# Altium project DTCP v1.2.PrjPcb (part 1 of 2)
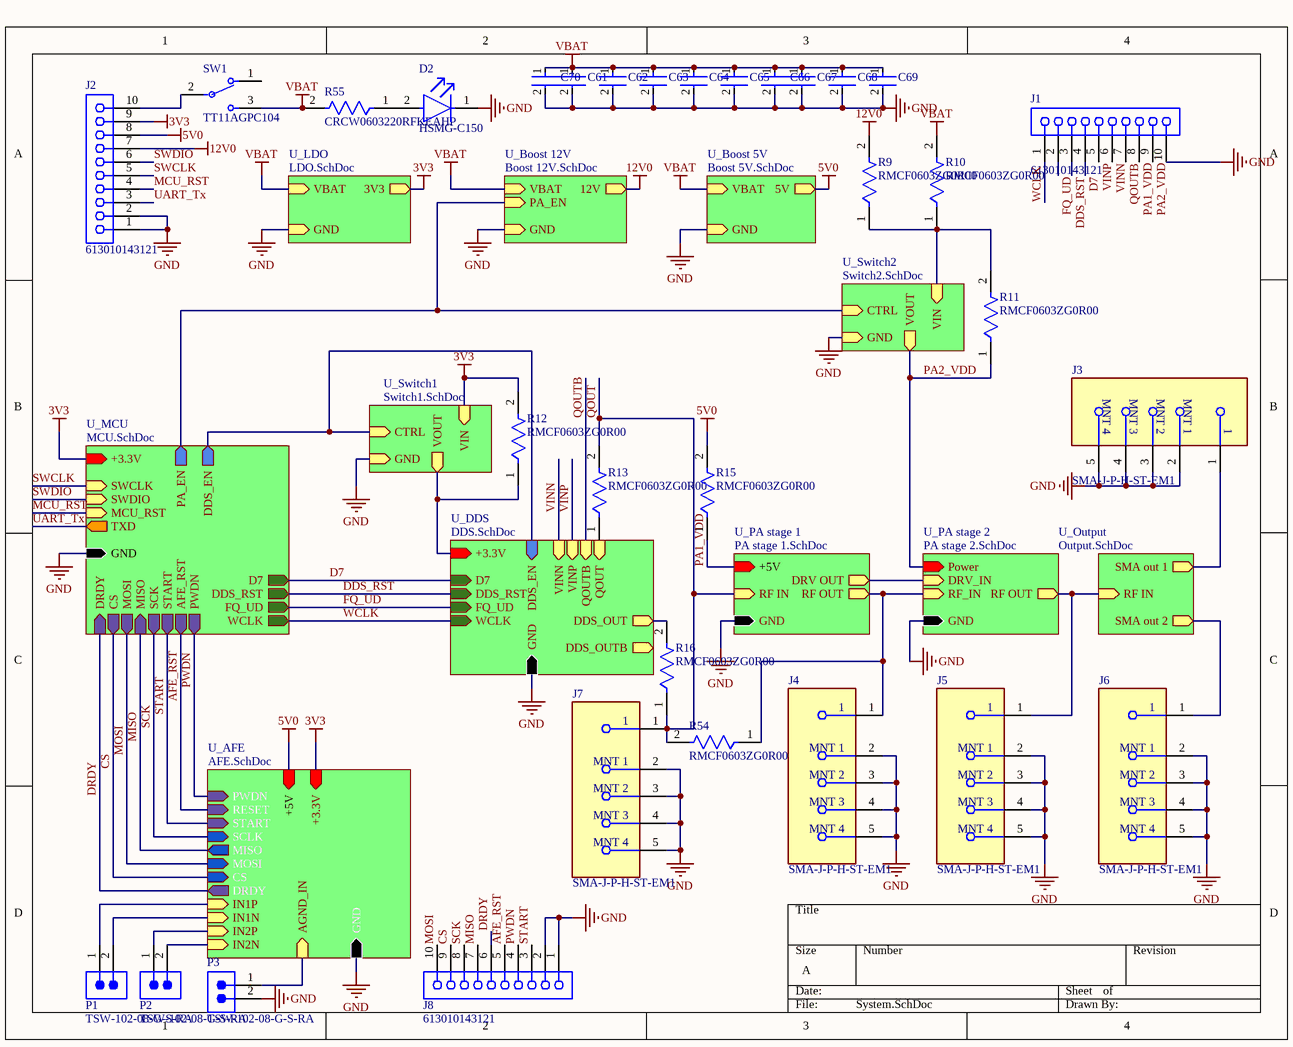
[diagram p0: System.SchDoc]
12 sheets, 176 parts. Net scope: hierarchical (ports join the sheet entries above them; power ports are global).
Board file: PCB1.PcbDoc
Sheets:
  System.SchDoc
    U_MCU = MCU.SchDoc
    U_DDS = DDS.SchDoc
    U_PA stage 1 = PA stage 1.SchDoc
    U_PA stage 2 = PA stage 2.SchDoc
    U_LDO = LDO.SchDoc
    U_Output = Output.SchDoc
    U_Boost 12V = Boost 12V.SchDoc
    U_Switch1 = Switch1.SchDoc
    U_Switch2 = Switch2.SchDoc
    U_Boost 5V = Boost 5V.SchDoc
    U_AFE = AFE.SchDoc

## Sheet System.SchDoc
size A; SheetNumber: 1; SheetTotal: 12

### Parts
C61  GRM21BR60J107ME15K  [FP-GRM21B-0_2-e0_2_0_7-IPC_B]  (value not drawn)
C62  GRM21BR60J107ME15K  [FP-GRM21B-0_2-e0_2_0_7-IPC_B]  (value not drawn)
C63  GRM21BR60J107ME15K  [FP-GRM21B-0_2-e0_2_0_7-IPC_B]  (value not drawn)
C64  GRM21BR60J107ME15K  [FP-GRM21B-0_2-e0_2_0_7-IPC_B]  (value not drawn)
C65  GRM21BR60J107ME15K  [FP-GRM21B-0_2-e0_2_0_7-IPC_B]  (value not drawn)
C66  GRM21BR60J107ME15K  [FP-GRM21B-0_2-e0_2_0_7-IPC_B]  (value not drawn)
C67  GRM21BR60J107ME15K  [FP-GRM21B-0_2-e0_2_0_7-IPC_B]  (value not drawn)
C68  GRM21BR60J107ME15K  [FP-GRM21B-0_2-e0_2_0_7-IPC_B]  (value not drawn)
C69  GRM21BR60J107ME15K  [FP-GRM21B-0_2-e0_2_0_7-IPC_B]  (value not drawn)
C70  GRM21BR60J107ME15K  [FP-GRM21B-0_2-e0_2_0_7-IPC_B]  (value not drawn)
D2  HSMG-C150  [FP-HSMG-C150-MFG]
J1  613010143121  [613010143121]
J2  613010143121  [613010143121]
J3  SMA-J-P-H-ST-EM1  [FP-SMA-J-P-H-ST-EM1-MFG]
J4  SMA-J-P-H-ST-EM1  [FP-SMA-J-P-H-ST-EM1-MFG]
J5  SMA-J-P-H-ST-EM1  [FP-SMA-J-P-H-ST-EM1-MFG]
J6  SMA-J-P-H-ST-EM1  [FP-SMA-J-P-H-ST-EM1-MFG]
J7  SMA-J-P-H-ST-EM1  [FP-SMA-J-P-H-ST-EM1-MFG]
J8  613010143121  [613010143121]
P1  TSW-102-08-G-S-RA  [SMTC-TSW-102-08-X-S-RA]
P2  TSW-102-08-G-S-RA  [SMTC-TSW-102-08-X-S-RA]
P3  TSW-102-08-G-S-RA  [SMTC-TSW-102-08-X-S-RA]
R9  RMCF0603ZG0R00  [FP-RMCF0603-IPC_B]
R10  RMCF0603ZG0R00  [FP-RMCF0603-IPC_B]
R11  RMCF0603ZG0R00  [FP-RMCF0603-IPC_B]
R12  RMCF0603ZG0R00  [FP-RMCF0603-IPC_B]
R13  RMCF0603ZG0R00  [FP-RMCF0603-IPC_B]
R15  RMCF0603ZG0R00  [FP-RMCF0603-IPC_B]
R16  RMCF0603ZG0R00  [FP-RMCF0603-IPC_B]
R54  RMCF0603ZG0R00  [FP-RMCF0603-IPC_B]
R55  CRCW0603220RFKEAHP  [FP-CRCW0603-HPe3-IPC_A]
SW1  TT11AGPC104  [FP-TT11AGPC104-MFG]

### Sub-sheets
U_AFE = AFE.SchDoc: +5V (in), GND (in), +3.3V (in), DRDY (out), CS (in), SCLK (in), MISO (out), MOSI (in), START (in), PWDN (in), RESET (in), IN1P (in), IN1N (in), IN2P (in), IN2N (in), AGND_IN (in)
U_Boost 5V = Boost 5V.SchDoc: VBAT (in), GND (in), 5V (out)
U_Boost 12V = Boost 12V.SchDoc: VBAT (in), GND (in), 12V (out), PA_EN (in)
U_DDS = DDS.SchDoc: DDS_OUTB (out), DDS_OUT (out), D7 (in), DDS_RST (in), FQ_UD (in), WCLK (in), +3.3V (in), GND (in), DDS_EN (in), VINN (in), VINP (in), QOUTB (in), QOUT (in)
U_LDO = LDO.SchDoc: VBAT (in), GND (in), 3V3 (out)
U_MCU = MCU.SchDoc: +3.3V (in), GND (in), SWCLK (in), SWDIO (in), MCU_RST (in), TXD (out), CS (out), MOSI (out), MISO (in), SCK (out), D7 (out), DDS_RST (out), FQ_UD (out), WCLK (out), PWDN (out), START (out), AFE_RST (out), PA_EN (out), DDS_EN (out), DRDY (in)
U_Output = Output.SchDoc: RF IN (in), SMA out 1 (out), SMA out 2 (out)
U_PA stage 1 = PA stage 1.SchDoc: RF IN (in), RF OUT (out), +5V (in), GND (in), DRV OUT (out)
U_PA stage 2 = PA stage 2.SchDoc: GND (in), RF OUT (out), Power (in), RF_IN (in), DRV_IN (in)
U_Switch1 = Switch1.SchDoc: VIN (in), VOUT (out), CTRL (in), GND (in)
U_Switch2 = Switch2.SchDoc: VIN (in), VOUT (out), CTRL (in), GND (in)

### Nets
3V3: J2.9 R12.2 ; sheet U_MCU/+3.3V, sheet U_LDO/3V3, sheet U_Switch1/VIN, sheet U_AFE/+3.3V
3V3DDS: R12.1 ; sheet U_DDS/+3.3V, sheet U_Switch1/VOUT
5V0: J2.8 R15.2 ; sheet U_Boost 5V/5V, sheet U_AFE/+5V
12V0: J2.7 R9.2 ; sheet U_Boost 12V/12V
GND: C61.2 C62.2 C63.2 C64.2 C65.2 C66.2 C67.2 C68.2 C69.2 C70.2 D2.1(C) J1.10 J2.1 J2.2 J3.2(MNT_1) J3.3(MNT_2) J3.4(MNT_3) J3.5(MNT_4) J4.2(MNT_1) J4.3(MNT_2) J4.4(MNT_3) J4.5(MNT_4) J5.2(MNT_1) J5.3(MNT_2) J5.4(MNT_3) J5.5(MNT_4) J6.2(MNT_1) J6.3(MNT_2) J6.4(MNT_3) J6.5(MNT_4) J7.2(MNT_1) J7.3(MNT_2) J7.4(MNT_3) J7.5(MNT_4) J8.1 J8.2 P3.2 ; sheet U_MCU/GND, sheet U_DDS/GND, sheet U_PA stage 1/GND, sheet U_PA stage 2/GND, sheet U_LDO/GND, sheet U_Boost 12V/GND, sheet U_Switch1/GND, sheet U_Switch2/GND, sheet U_Boost 5V/GND, sheet U_AFE/GND
PA1_VDD: J1.8 R15.1 ; sheet U_PA stage 1/+5V
VBAT: C61.1 C62.1 C63.1 C64.1 C65.1 C66.1 C67.1 C68.1 C69.1 C70.1 R10.2 R55.2 SW1.3 ; sheet U_LDO/VBAT, sheet U_Boost 12V/VBAT, sheet U_Boost 5V/VBAT
AFE_RST: J8.5 ; sheet U_MCU/AFE_RST, sheet U_AFE/RESET
CS: J8.9 ; sheet U_MCU/CS, sheet U_AFE/CS
D7: J1.4 ; sheet U_MCU/D7, sheet U_DDS/D7
DDS_OUT: R16.2 ; sheet U_DDS/DDS_OUT
DDS_RST: J1.3 ; sheet U_MCU/DDS_RST, sheet U_DDS/DDS_RST
DRDY: J8.6 ; sheet U_MCU/DRDY, sheet U_AFE/DRDY
FQ_UD: J1.2 ; sheet U_MCU/FQ_UD, sheet U_DDS/FQ_UD
MCU_RST: J2.4 ; sheet U_MCU/MCU_RST
MISO: J8.7 ; sheet U_MCU/MISO, sheet U_AFE/MISO
MOSI: J8.10 ; sheet U_MCU/MOSI, sheet U_AFE/MOSI
PA2_VDD: J1.9 R11.1 ; sheet U_PA stage 2/Power, sheet U_Switch2/VOUT
PWDN: J8.4 ; sheet U_MCU/PWDN, sheet U_AFE/PWDN
QOUT: J7.1 R13.2 R16.1 R54.2 ; sheet U_PA stage 1/RF IN
QOUTB: J1.7 ; sheet U_DDS/QOUTB
SCK: J8.8 ; sheet U_MCU/SCK, sheet U_AFE/SCLK
START: J8.3 ; sheet U_MCU/START, sheet U_AFE/START
SWCLK: J2.5 ; sheet U_MCU/SWCLK
SWDIO: J2.6 ; sheet U_MCU/SWDIO
UART_Tx: J2.3 ; sheet U_MCU/TXD  [project net TXD]
VINN: J1.6 ; sheet U_DDS/VINN
VINP: J1.5 ; sheet U_DDS/VINP
WCLK: J1.1 ; sheet U_MCU/WCLK, sheet U_DDS/WCLK  [project net DDS_WCLK]
NetC47_2: R9.1 R10.1 R11.2 ; sheet U_Switch2/VIN
NetD2_2: D2.2(A) R55.1
NetJ2_10: J2.10 SW1.2
NetJ3_1: J3.1 ; sheet U_Output/SMA out 1
NetJ4_1: J4.1 R54.1 ; sheet U_PA stage 1/RF OUT, sheet U_PA stage 2/RF_IN
NetJ5_1: J5.1 ; sheet U_PA stage 2/RF OUT, sheet U_Output/RF IN
NetJ6_1: J6.1 ; sheet U_Output/SMA out 2
NetP1_1: P1.1 ; sheet U_AFE/IN1P
NetP1_2: P1.2 ; sheet U_AFE/IN1N
NetP2_1: P2.1 ; sheet U_AFE/IN2P
NetP2_2: P2.2 ; sheet U_AFE/IN2N
NetP3_1: P3.1 ; sheet U_AFE/AGND_IN
NetQ1_1: sheet U_PA stage 1/DRV OUT, sheet U_PA stage 2/DRV_IN
NetR1_2: sheet U_MCU/DDS_EN, sheet U_DDS/DDS_EN, sheet U_Switch1/CTRL
NetR13_1: R13.1 ; sheet U_DDS/QOUT
NetR?#2_1: sheet U_MCU/PA_EN, sheet U_Boost 12V/PA_EN, sheet U_Switch2/CTRL

Not connected (* = marked no-connect by the designer): SW1 1

### Library data of the parts
C61-C70 = CMP-06035-052658-1: Chip Multilayer Ceramic Capacitors for General Purpose, 0805, 100uF, X5R, 15%, 20%, 6.3V; Voltage Rating (DC): 6.3V; Lead Free: Lead Free; Length: 2mm; Tolerance: 20%; Width: 1.25mm; Capacitance: 100uF; Dielectric: X5R; Thickness: 1.25mm
D2 = CMP-2000-05061-2: LED GREEN DIFFUSED 1206 SMD; Manufacturer: Broadcom; Led Orientation: Top View; Max Junction Temp: +95°C; Peak Emmision Wavelength: 570nm; Viewing Angle: 170°; Wavelength: 572nm; Reverse Voltage: 5V; Luminous Intensity: 15mcd; Forward Voltage: 2.2V; Power Dissipation: 65mW; Forward Current: 20mA; ComponentLink2Description: Datasheet; Lead Free: Yes; Temperature Range Low: -40°C; Package: HSMG-C150; Digikey Description: LED GREEN DIFFUSED 1206 SMD; Mouser Description: LED Uni-Color Green 570nm 2-Pin Chip LED T/R; Manufacturer Part Number: HSMG-C150; Temperature Range High: +85°C; Device Class L1: Optoelectronics; Colour: Green; Category: Diode; Device Class L3: unset; RoHS: TRUE; Height: 1.2mm; ComponentLink2URL: https://docs.broadcom.com/docs/AV02-0551EN; Device Class L2: LEDs; Automotive: No; Ipc Land Pattern Name: DIOCP320160X55; Octopart: https://octopart.com/hsmg-c150-broadcom-71131304; Temperature: -40°C to +85°C
J1 J2 J8 = CMP-1502-01419-3: NexarPartId: 18818161; Operating Supply Voltage: 250V; Contact Resistance: 20mΩ; Gender: Female; Insulation Resistance: 1GΩ; Connector Type: Header, Socket; Insulation: Insulated; Current Rating: 3A; Number of Positions: 10; Pitch: 2.54mm; Number of Rows: 1; Number of Pins: 10; Voltage Rating: 250V; Length: 25.9mm; Contact Gender: Female; RoHS: Compliant; Contact Plating: Gold; Height: 8.5mm; Min Operating Temperature: -40°C; Contact Material: Copper; Number of Contacts: 10; REACH SVHC: Unknown; Mount: Through Hole; Lead Pitch: 2.54mm; Width: 25.9mm; Max Operating Temperature: 125°C; Flammability Rating: UL94 V-0; Termination: Through Hole; Color: Black; Housing Material: PBT
J3-J7 = CMP-02754-000006-1: CONN SMA JACK STR 50OHM EDGE MNT; Dielectric Material: PTFE; Center Contact Plating: Gold; Max Frequency: 6GHz; Body Material: Brass; Voltage Rating: 335V; Impedance: 50R; Package Quantity: 1; Case/Package: SMA; Max Operating Temperature: 125°C; Fastening Type: Threaded; Orientation: Straight; Depth: 13.33mm; RoHS Compliant: Yes; Length: 6.35mm; Insulation Material: Polytetrafluoroethylene; Termination: Solder; Min Operating Temperature: -65°C; Housing Color: Gold; Contact Plating: Gold; Contact Material: Copper; Connector Type: SMA; Mount: Edge; Series: SMA; Packaging: Tray; Body Plating: Gold; Radiation Hardening: No
P1-P3 = CMP-1024-00320-1: 0.025" SQ Post Header, Through-hole, Right Angle, -55 to 125 degC, 2.54 mm Pitch, 2-Pin, Male, RoHS; Manufacturer: Samtec; Pitch: 2.54 mm; Temperature Range: -55 to 125 degC; PackageDescription: .025[0.64] SQ. Post Terminal Strip Assembly; ComponentLink3Description: Package Specification; ComponentLink2Description: Datasheet; PackageReference: TSW-102-08-X-S-RA; ComponentLink1Description: Manufacturer URL; ComponentLink2URL: http://www.samtec.com/documents/webfiles/pdf/TSW_TH.PDF; PackageVersion: DM, 8/1988; RoHS: True; PartNumber: TSW-102-08-G-S-RA; Mounting Technology: Through-hole; Orientation: Right Angle; ComponentLink1URL: http://www.samtec.com; DatasheetVersion: F-214; ComponentLink3URL: http://www.samtec.com/documents/webfiles/cpdf/TSW-XXX-XX-XXX-X-XX-XXX-MKT.pdf
R9-R13 R15 R16 R54 = CMP-26527-006412-1: 0Ω ±0 0.1W 0603 Thick Film Chip Resistor AEC-Q200 compliant; Max Power Dissipation: 100mW; Resistance: 0R; Width: 0.031inch; RoHS Compliant: Yes; Number of Terminations: 2; Case/Package: 0603; Contact Plating: Tin; Height: 0.022inch; Resistor Type: Thick Film; Mount: Surface Mount; Length: 0.061inch; Features: Automotive AEC-Q200; Series: RMCF; Max Operating Temperature: 155°C; Radiation Hardening: No; Min Operating Temperature: -55°C; Packaging: Tape and Reel
R55 = CMP-02407-003593-1: RES Thick Film, 220Ω, 1%, 0.33W, 100ppm/°C, 0603; Max Power Dissipation: 250mW; Voltage Rating (DC): 75V; Resistance: 220R; Radiation Hardening: No; Contact Plating: Tin; Length: 1.6mm; Depth: 0.85mm; Composition: Thick Film; Lead Free: Lead Free; Mount: Surface Mount; Package Quantity: 5000; Height: 0.45mm; Termination: SMD/SMT; Weight: 7.1E-05oz; Military Standard: Not; Number of Terminations: 2; Case Code (Metric): 1608; Max Operating Temperature: 155°C; Power Rating: 250mW; Tolerance: 1%; Temperature Coefficient: 100ppm/°C; Features: Automotive AEC-Q200; Case Code (Imperial): 0603; Width: 0.033inch; Min Operating Temperature: -55°C; Case/Package: 0603; Voltage Rating: 75V; Packaging: Tape and Reel
SW1 = CMP-03408-000020-1: SWITCH TOGGLE SPST 0.4VA 20V; Illumination Type: Illuminated; Actuator Length: 5.61mm; Contact Current Rating: 3A; Power Rating: 400mW; Voltage Rating (AC): 20V; Packaging: Bulk; Max Voltage Rating (DC): 20V; Actuator Type: Toggle; Orientation: Straight; RoHS Compliant: Yes; Throw Configuration: SPST; Min Operating Temperature: -30°C; Voltage Rating (DC): 20V; Series: TT (Tiny); Contact Plating: Gold; Package Quantity: 25; Max Operating Temperature: 85°C; Mount: Brackets; Termination: PC Pins; Max Voltage Rating (AC): 20V

## Sheet MCU.SchDoc
size A; SheetNumber: 2; SheetTotal: 12
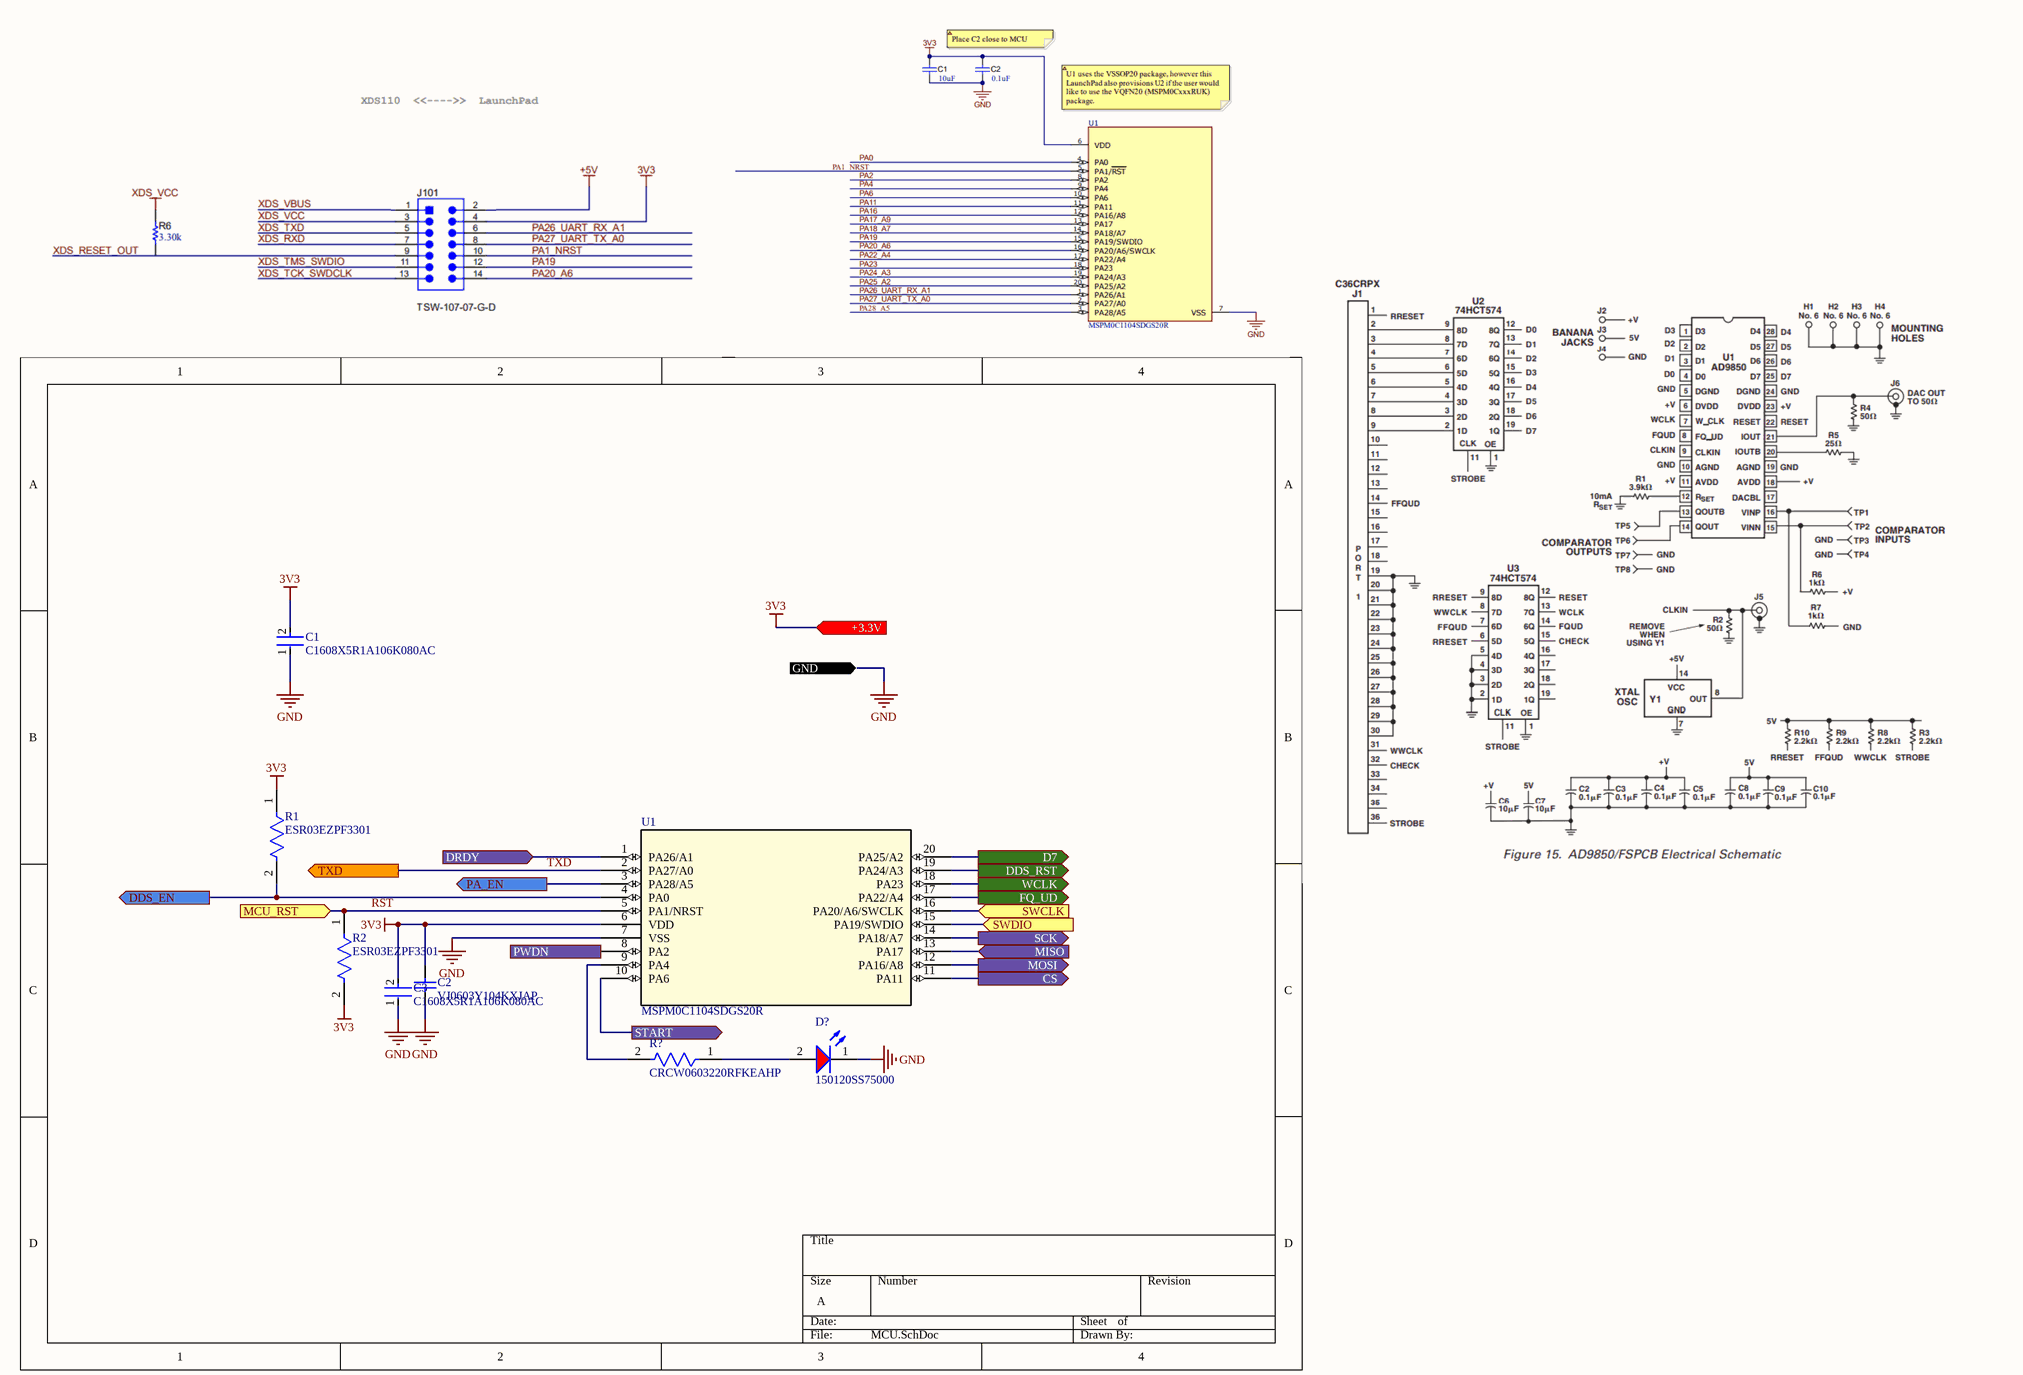
[diagram p1: MCU.SchDoc]

### Parts
(Parts that share a designator on the sheet are numbered #1, #2 ... from top to bottom, then left to right.)
C1  C1608X5R1A106K080AC  [FP-C1608-080-0_1-MFG]
C2  VJ0603Y104KXJAP  [CAPC1608X92X38NL15T08]
C3  C1608X5R1A106K080AC  [FP-C1608-080-0_1-MFG]
D?  150120SS75000  [WL-SMCW_1206_150120xx75000]
R1  ESR03EZPF3301  [FP-ESR03-IPC_A]
R2  ESR03EZPF3301  [FP-ESR03-IPC_A]
R?#1  CRCW0603220RFKEAHP  [FP-CRCW0603-HPe3-IPC_A]
U1  MSPM0C1104SDGS20R  [DGS0020A_TEX]

### Ports
+3.3V (in), CS (out), D7 (out), DDS_EN (out), DDS_RST (out), DRDY (in), FQ_UD (out), GND (in), MCU_RST (in), MISO (in), MOSI (out), PA_EN (out), PWDN (out), SCK (out), START (out), SWCLK (in), SWDIO (in), TXD (out), WCLK (out)

### Nets
3V3: C1.2 C2.2 C3.2 R1.1 R2.2 U1.6(VDD) ; port +3.3V
GND: C1.1 C2.1 C3.1 D?.1(K) U1.7(VSS) ; port GND
CS: U1.11(PA11) ; port CS
D7: U1.20(PA25/A2) ; port D7
DDS_RST: U1.19(PA24/A3) ; port DDS_RST
DDS_WCLK: U1.18(PA23) ; port WCLK
DRDY: U1.1(PA26/A1) ; port DRDY
FQ_UD: U1.17(PA22/A4) ; port FQ_UD
MISO: U1.13(PA17) ; port MISO
MOSI: U1.12(PA16/A8) ; port MOSI
PWDN: U1.8(PA2) ; port PWDN
RST: R2.1 U1.5(PA1/NRST) ; port MCU_RST  [project net MCU_RST]
SCK: U1.14(PA18/A7) ; port SCK
START: U1.10(PA6) ; port START
SWCLK: U1.16(PA20/A6/SWCLK) ; port SWCLK
SWDIO: U1.15(PA19/SWDIO) ; port SWDIO
TXD: U1.2(PA27/A0) ; port TXD
NetD?_2: D?.2(A) R?#1.1
NetR1_2: R1.2 U1.4(PA0) ; port DDS_EN
NetR?#1_2: R?#1.2 U1.9(PA4)
NetR?#2_1: U1.3(PA28/A5) ; port PA_EN

### Library data of the parts
C1 C3 = CMP-2000-04979-3: Multilayer Ceramic Capacitors 10μF ±10% 10V X5R SMD 0603; Capacitance: 10uF; Dielectric Material: Ceramic; Construction: Flat; Height: 0.8mm; Thickness: 0.035inch; Case Code (Metric): 1608; Radiation Hardening: No; Number of Pins: 2; Voltage Rating (DC): 10V; Depth: 0.8mm; Voltage: 10V; RoHS Compliant: Yes; Voltage Rating: 10V; Package Quantity: 1; Resistor Type: Ceramic; Termination: SMD/SMT; Lead Free: Lead Free; REACH SVHC: No SVHC; Tolerance: 10%; Mount: Surface Mount; Series: C; Packaging: Tape and Reel; Width: 0.8mm; Dielectric: X5R; Weight: 7.1E-05oz; Length: 1.6mm; Max Operating Temperature: 85°C; Case Code (Imperial): 0603; Case/Package: 0603; Min Operating Temperature: -55°C
C2 = CMP-2006-01211-1: Manufacturer: Vitramon; Part Number: VJ0603Y104KXJAP
D? = CMP-1426-00017-3: Led, Red, 630 Nm, 1.9 V, 30 Ma, 60 Mcd Rohs Compliant: Yes; Forward Current: 100mA; Max Reverse Voltage (DC): 5V; Lens Style: Clear, Rectangular; Viewing Angle: 140°; Luminous Intensity: 60mcd; Peak Wavelength: 645nm; Forward Voltage: 1.9V; Test Current: 20mA; Dominant Wavelength: 630nm; Case Code (Imperial): 1206; Length: 3.2mm; Mount: Surface Mount; Case Code (Metric): 3216; Case/Package: 1206; Min Operating Temperature: -40°C; Width: 1.6mm; Color: Red; Height: 680µm; REACH SVHC: Unknown; Max Operating Temperature: 85°C; Wavelength: 630nm; RoHS: Compliant; Packaging: Tape and Reel
R1 R2 = CMP-08839-028747-1: 3.3kΩ ±1% 0.25W 0603 Anti-Surge Chip Resistor AEC-Q200; Temperature Coefficient: 100ppm/°C; Resistance: 3.3kR; Max Power Dissipation: 250mW; Tolerance: 1%; Min Operating Temperature: -55°C; Features: Automotive AEC-Q200; Max Operating Temperature: 155°C; Number of Terminations: 2; Series: ESR; Packaging: Tape and Reel; Resistor Type: Thick Film; RoHS Compliant: Yes; Case/Package: 0603
R?#1 = CMP-02407-003593-1: as R55 on sheet System; Radiation Hardening: No; Contact Plating: Tin; Length: 1.6mm; Depth: 0.85mm; Composition: Thick Film; Lead Free: Lead Free; Mount: Surface Mount; Package Quantity: 5000; Height: 0.45mm; Termination: SMD/SMT; Weight: 7.1E-05oz; Military Standard: Not; Number of Terminations: 2; Case Code (Metric): 1608; Max Operating Temperature: 155°C; Power Rating: 250mW; Tolerance: 1%; Temperature Coefficient: 100ppm/°C; Features: Automotive AEC-Q200; Case Code (Imperial): 0603; Width: 0.033inch; Min Operating Temperature: -55°C; Case/Package: 0603; Voltage Rating: 75V; Packaging: Tape and Reel
U1 = MSPM0C1104SDGS20R: 24MHz ArmÂ® CortexÂ®-M0+ MCU with 16KB flash, 1KB SRAM, 12-bit ADC 20-VSSOP -40 to 125; Manufacturer_Name: Texas Instruments; Copyright: Copyright (C) 2025 Ultra Librarian. All rights reserved.; Manufacturer_Part_Number: MSPM0C1104SDGS20R; Datasheet: https://www.ti.com/lit/gpn/mspm0c1104; RefDes: RefDes; Type: Type

## Sheet DDS.SchDoc
size A; SheetNumber: 5; SheetTotal: 12
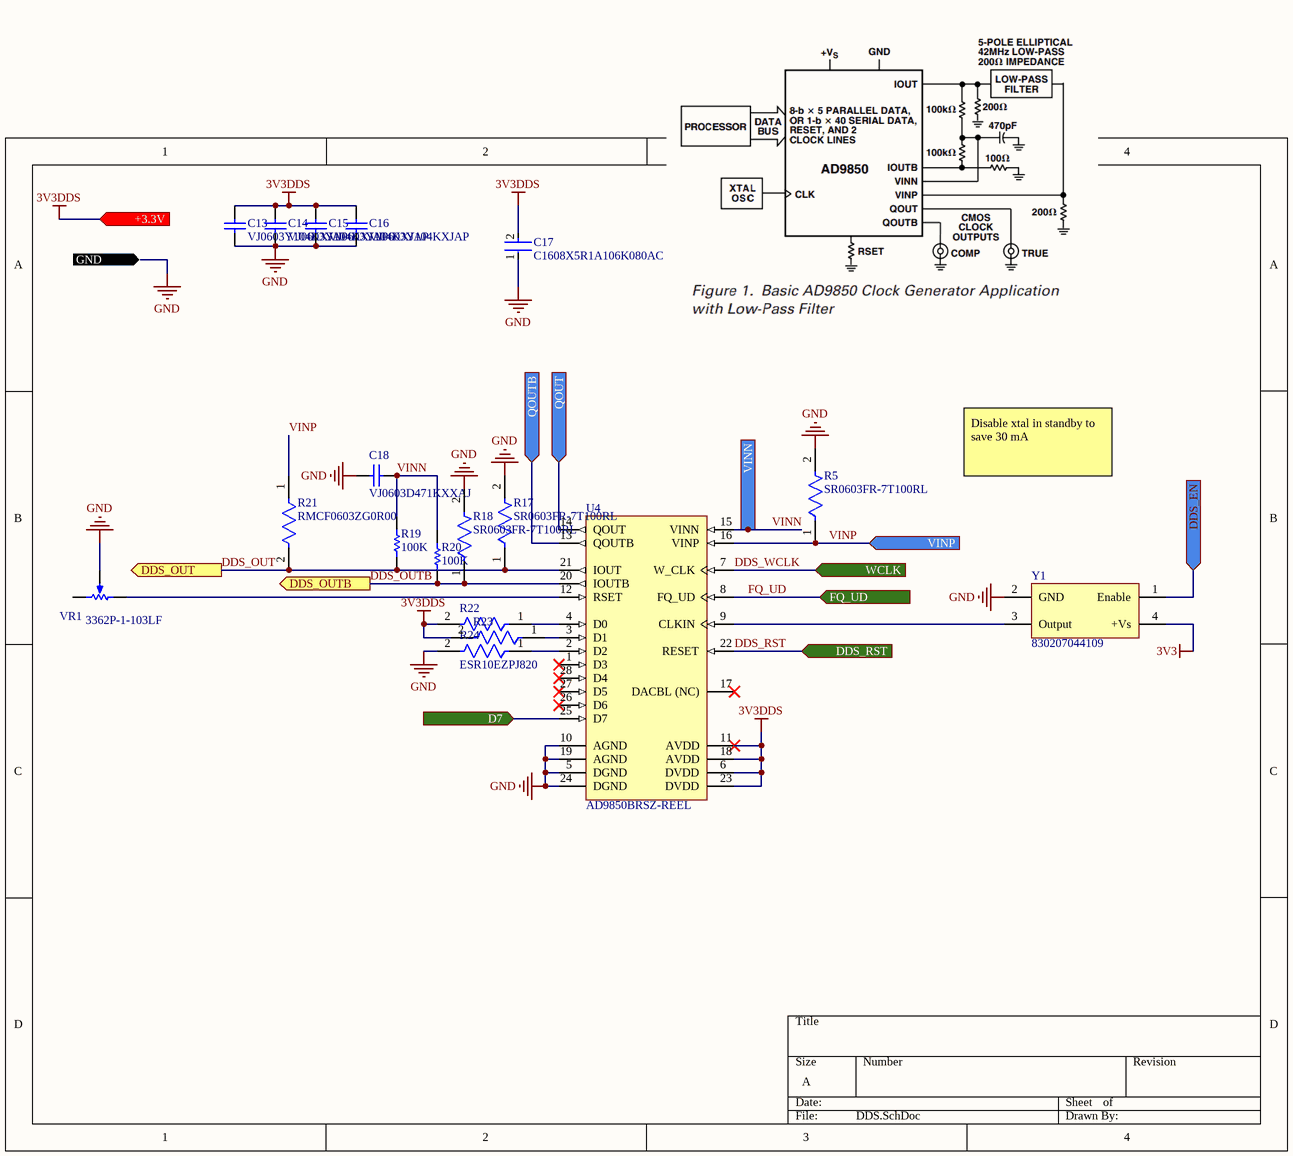
[diagram p2: DDS.SchDoc]

### Parts
C13  VJ0603Y104KXJAP  [CAPC1608X92X38NL15T08]
C14  VJ0603Y104KXJAP  [CAPC1608X92X38NL15T08]
C15  VJ0603Y104KXJAP  [CAPC1608X92X38NL15T08]
C16  VJ0603Y104KXJAP  [CAPC1608X92X38NL15T08]
C17  C1608X5R1A106K080AC  [FP-C1608-080-0_1-MFG]
C18  VJ0603D471KXXAJ  [CAPC1608X92X38LL15T08]
R5  SR0603FR-7T100RL  [FP-SR0603-MFG]
R17  SR0603FR-7T100RL  [FP-SR0603-MFG]
R18  SR0603FR-7T100RL  [FP-SR0603-MFG]
R19  100K  [RESC0603(1608)_N]
R20  100K  [RESC0603(1608)_N]
R21  RMCF0603ZG0R00  [FP-RMCF0603-IPC_B]
R22  ESR10EZPJ820  [FP-ESR10-IPC_C]  (value not drawn)
R23  ESR10EZPJ820  [FP-ESR10-IPC_C]  (value not drawn)
R24  ESR10EZPJ820  [FP-ESR10-IPC_C]
U4  AD9850BRSZ-REEL  [ADI-RS-28_N]
VR1  3362P-1-103LF  [BOUR-3362P]
Y1  830207044109  [WE-SPXO_CFPS-39]

### Ports
+3.3V (in), D7 (in), DDS_EN (in), DDS_OUT (out), DDS_OUTB (out), DDS_RST (in), FQ_UD (in), GND (in), QOUT (in), QOUTB (in), VINN (in), VINP (in), WCLK (in)

### Nets
3V3: Y1.4(+Vs)
3V3DDS: C13.2 C14.2 C15.2 C16.2 C17.2 R22.2 R23.2 U4.6(DVDD) U4.11(AVDD) U4.18(AVDD) U4.23(DVDD) ; port +3.3V
GND: C13.1 C14.1 C15.1 C16.1 C17.1 C18.2 R5.2 R17.2 R18.2 R24.2 U4.5(DGND) U4.10(AGND) U4.19(AGND) U4.24(DGND) VR1.2(S) Y1.2(GND) ; port GND
D7: U4.25(D7) ; port D7
DDS_OUT: R17.1 R19.1 R21.2 U4.21(IOUT) ; port DDS_OUT
DDS_OUTB: R18.1 R20.1 U4.20(IOUTB) ; port DDS_OUTB
DDS_RST: U4.22(RESET) ; port DDS_RST
DDS_WCLK: U4.7(W_CLK) ; port WCLK
FQ_UD: U4.8(FQ_UD) ; port FQ_UD
QOUTB: U4.13(QOUTB) ; port QOUTB
VINN: C18.1 R19.2 R20.2 U4.15(VINN) ; port VINN
VINP: R5.1 R21.1 U4.16(VINP) ; port VINP
NetR1_2: Y1.1(Enable) ; port DDS_EN
NetR13_1: U4.14(QOUT) ; port QOUT
NetR22_1: R22.1 U4.4(D0)
NetR23_1: R23.1 U4.3(D1)
NetR24_1: R24.1 U4.2(D2)
NetU4_9: U4.9(CLKIN) Y1.3(Output)
NetU4_12: U4.12(RSET) VR1.1(CCW)

Not connected (* = marked no-connect by the designer): U4 1(D3)* 17(DACBL_(NC))* 26(D6)* 27(D5)* 28(D4)*; VR1 3(CW)

### Notes on the sheet
- Disable xtal in standby to save 30 mA

### Library data of the parts
C13-C16 = CMP-2006-01211-1: Manufacturer: Vitramon; Part Number: VJ0603Y104KXJAP
C17 = CMP-2000-04979-3: as C1 on sheet MCU; Dielectric Material: Ceramic; Construction: Flat; Height: 0.8mm; Thickness: 0.035inch; Case Code (Metric): 1608; Radiation Hardening: No; Number of Pins: 2; Voltage Rating (DC): 10V; Depth: 0.8mm; Voltage: 10V; RoHS Compliant: Yes; Voltage Rating: 10V; Package Quantity: 1; Resistor Type: Ceramic; Termination: SMD/SMT; Lead Free: Lead Free; REACH SVHC: No SVHC; Tolerance: 10%; Mount: Surface Mount; Series: C; Packaging: Tape and Reel; Width: 0.8mm; Dielectric: X5R; Weight: 7.1E-05oz; Length: 1.6mm; Max Operating Temperature: 85°C; Case Code (Imperial): 0603; Case/Package: 0603; Min Operating Temperature: -55°C
C18 = CMP-2006-01521-1: Manufacturer: Vitramon; Part Number: VJ0603D471KXXAJ
R5 R17 R18 = CMP-03412-002710-1: RES SMD 0603 1/4W 1% 100 OHM; Manufacturer: Yageo; Power Rating: 0.25W; Description: SR0603 100Ω 0.25W 1.00%; Voltage Rating: 75V; Automotive Grade: Grade 0; Resistance: 100Ω; Tolerance: 0.01; Value: 100Ω; Height: 0.55mm; Device Class L2: Resistors; RoHS: TRUE; Temperature Range High: +155°C; Device Class L3: Chip SMD Resistors; Category: Res; Device Class L1: Passive Components; Manufacturer Part Number: SR0603FR-7T100RL; Temperature Range Low: -55°C; Temperature: -55°C to +155°C; Lead Free: Yes; Octopart: https://octopart.com/sr0603fr-7t100rl-yageo-91478072; ComponentLink2URL: http://www.yageo.com/documents/recent/PYu-SR_D_F%20tol_RoHS_L_3.pdf; Series: SR; Automotive: Yes; Footprint Url: http://www.yageo.com/exep/pages/download/literatures/PYu-R_Mount_10.pdf; Package: SR0603; ComponentLink2Description: Datasheet; Composition: Thick Film; Ipc Land Pattern Name: RESC16080X45; Digikey Description: RES SMD 0603 1/4W 1% 100 OHM
R19 R20 = CMP-1012-00736-1: 100K 0.1W 1% 0603 (1608 Metric)  SMD; Value: 100000.00 Ohm; Case-Metric: 1608; Case-EIA: 0603; Power: 0.1 W; Tolerance: 1 %; Technology: SMT
R21 = CMP-26527-006412-1: as R9 on sheet System; Width: 0.031inch; RoHS Compliant: Yes; Number of Terminations: 2; Case/Package: 0603; Contact Plating: Tin; Height: 0.022inch; Resistor Type: Thick Film; Mount: Surface Mount; Length: 0.061inch; Features: Automotive AEC-Q200; Series: RMCF; Max Operating Temperature: 155°C; Radiation Hardening: No; Min Operating Temperature: -55°C; Packaging: Tape and Reel
R22-R24 = CMP-08839-027843-1: 82Ω ±5% 0.4W 0805 Anti-Surge Chip Resistor AEC-Q200; Temperature Coefficient: 200ppm/°C; Resistance: 82R; Max Power Dissipation: 400mW; Power Rating: 250mW; Size Code: 0805; Tolerance: 5%; RoHS Compliant: Yes; Series: ESR; Lead Free: Lead Free; Case/Package: 0805; Number of Terminations: 2; Packaging: Cut Tape; Features: Automotive AEC-Q200; Case Code (Imperial): 0805; Case Code (Metric): 2012
U4 = CMP-0293-00041-1: CMOS, 125 MHz Complete DDS Synthesizer, 10-Bit, Parallel, Serial, RS-28, 1500 Reel, Pb-Free; Tuning Word Width (bits): 32bit; Master fclk: 125MHz; Resolution (Bits): 10bit; REFCLK Multiplier: No; Compliance Range (V): 1.5V; FS Iout (mA nom): 20mA; I Supply total (max): 96mA; ComponentLink3Description: Package Specification; Code_JEDEC: MO-150-AH; ComponentLink1URL: www.analog.com; I/O Interface: Parallel, Serial; PackageDescription: 28-Lead Shrink Small Outline Package [SSOP]; ComponentLink2URL: http://www.analog.com/static/imported-files/data_sheets/AD9850.pdf; ComponentLink3URL: http://www.analog.com/static/imported-files/packages/32122249223724RS_28.pdf; ComponentLink2Description: Datasheet; PackageVersion: revA, 1997; ComponentLink1Description: Manufacturer URL; PackageReference: RS-28; DatasheetVersion: Rev. H
VR1 = CMP-1747-00004-1: Square Trimpot(R) Trimming Potentiometer, 10 KOhm, 300 V, -55 to 125 degC, 3-Pin THD, RoHS, Tube; Voltage Rating: 220 mV; Power Rating: 1 W; Tolerance: 1%; Resistance: 50 mohm; Case/Package: 1206; Length: 3.2 mm; RoHSCompliant: True; PackageDescription: 3-Pin Through Hole Device, Body 6.6 x 6.99 mm, Pitch 2.54 mm; ComponentLink2Description: Datasheet; REACH SVHC: No SVHC; Mount: Surface Mount; Height: 0.6 mm; Packaging: Tape and Reel; ComponentLink1URL: http://www.bourns.com/; Case Code (Imperial): 0612; Pins: 2; Case Code (Metric): 1632; ComponentLink2URL: http://www.bourns.com/docs/Product-Datasheets/3362.pdf; Min Operating Temperature: -25degC; ComponentLink1Description: Manufacturer URL; PackageReference: 3326P; Max Operating Temperature: 125degC; Width: 1.6 mm; Package Quantity: 5000; DatasheetVersion: May-16
Y1 = CMP-03913-116855802-1: 830207044109 WE-SPXO Crystal Oscillator; Frequency: 100MHz; NexarPartId: 116855802; Length: 3.2mm; Width: 2.5mm; Max Operating Temperature: 85°C; Height: 1.2mm; Min Operating Temperature: -40°C

## Sheet PA stage 1.SchDoc
size A; SheetNumber: 8; SheetTotal: 12
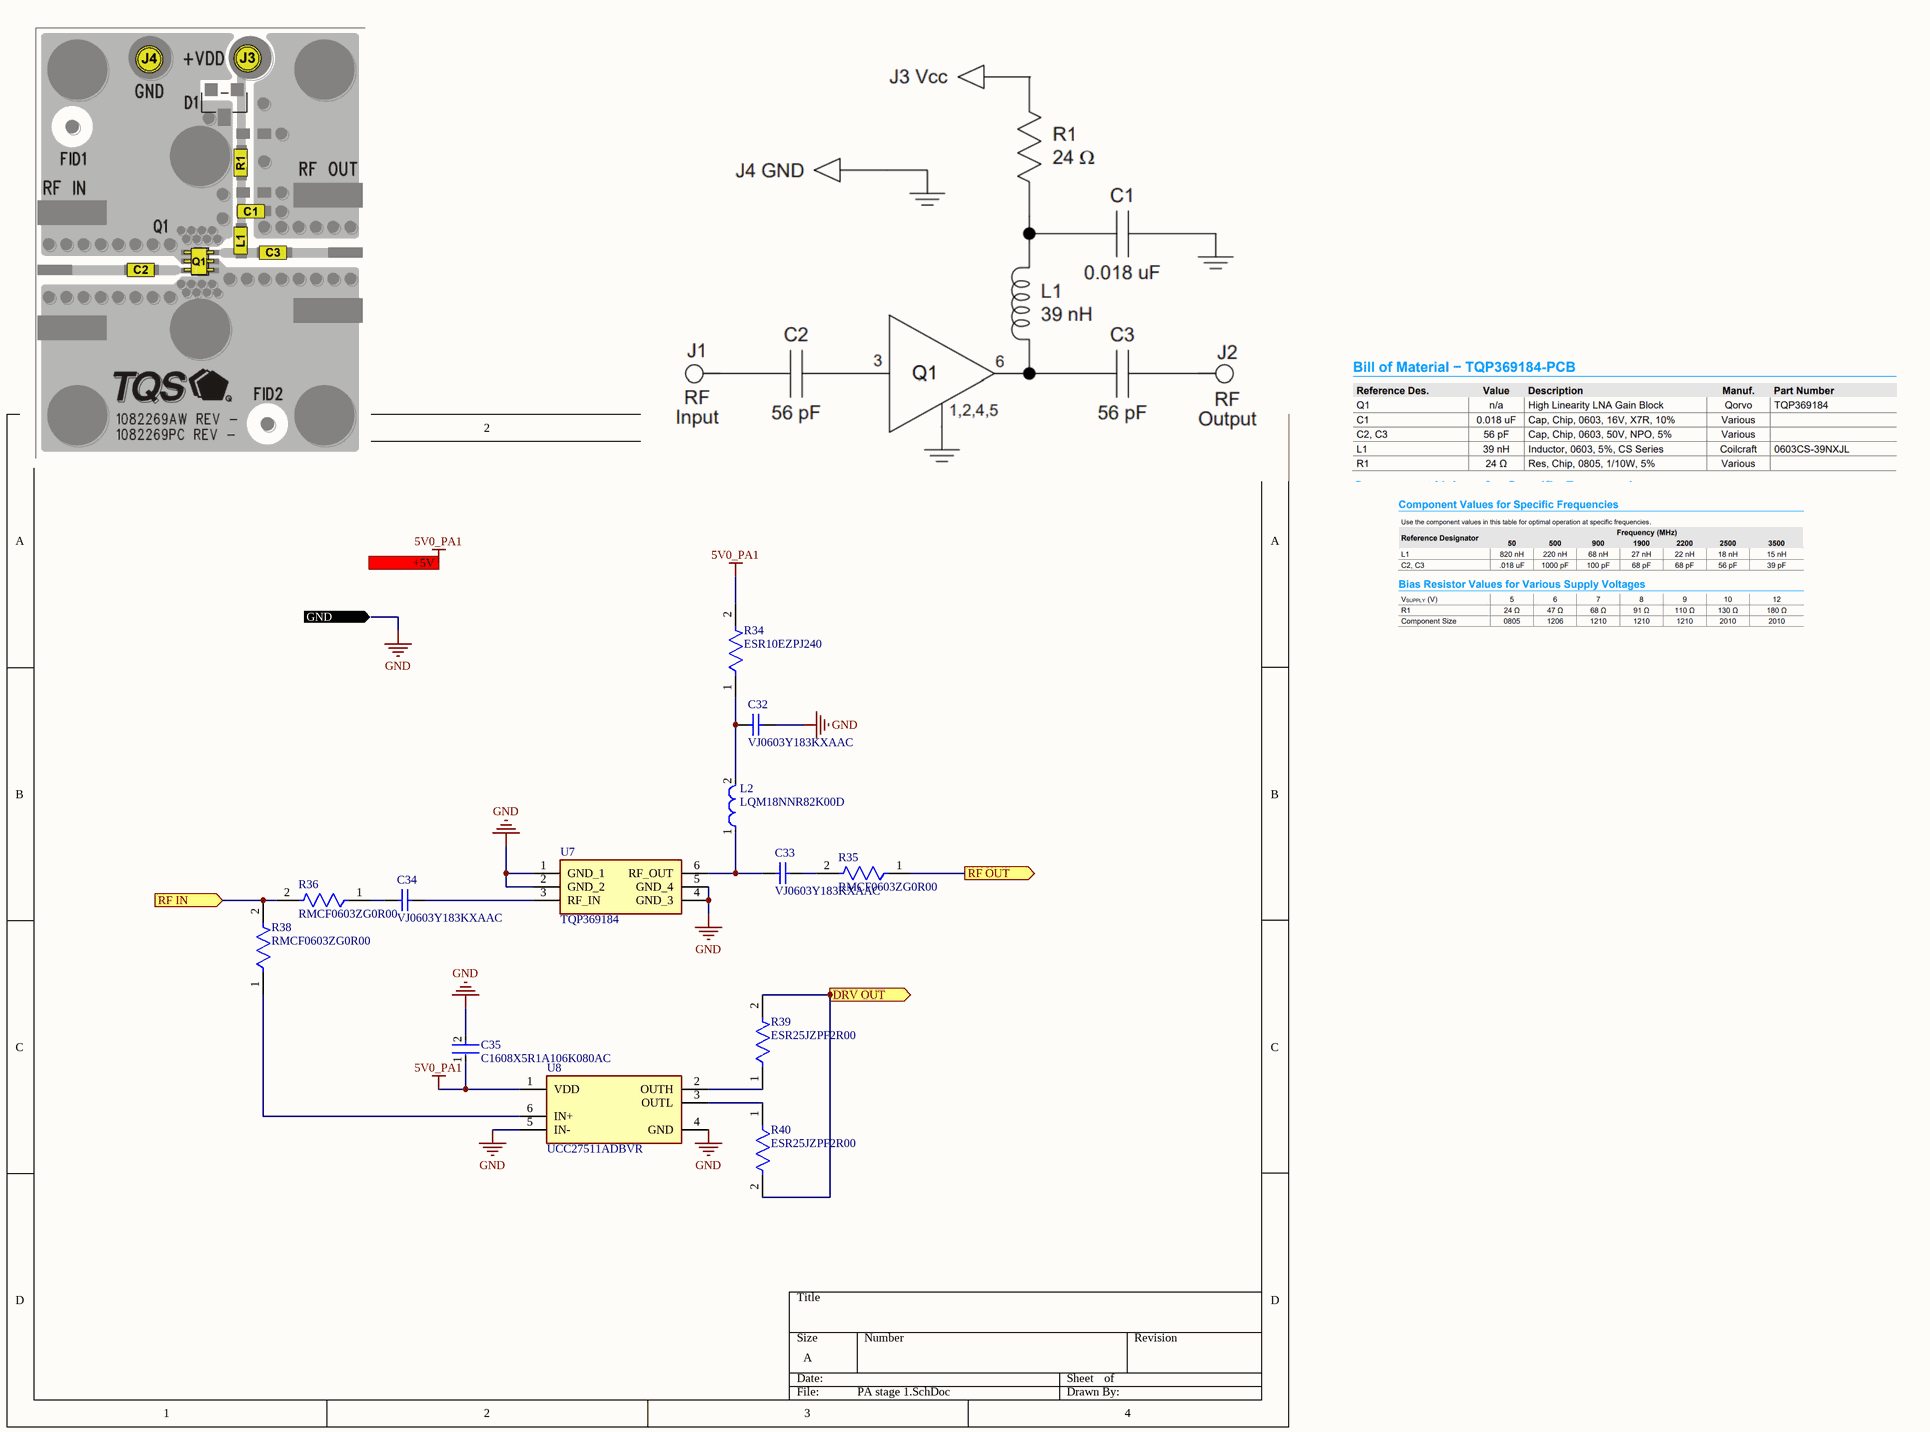
[diagram p3: PA stage 1.SchDoc]

### Parts
C32  VJ0603Y183KXAAC  [CAPC1608X92X38ML15T08]
C33  VJ0603Y183KXAAC  [CAPC1608X92X38ML15T08]
C34  VJ0603Y183KXAAC  [CAPC1608X92X38ML15T08]
C35  C1608X5R1A106K080AC  [FP-C1608-080-0_1-MFG]
L2  LQM18NNR82K00D  [FP-LQM18NN_00-IPC_B]
R34  ESR10EZPJ240  [FP-ESR10-IPC_C]
R35  RMCF0603ZG0R00  [FP-RMCF0603-IPC_B]
R36  RMCF0603ZG0R00  [FP-RMCF0603-IPC_B]
R38  RMCF0603ZG0R00  [FP-RMCF0603-IPC_B]
R39  ESR25JZPF2R00  [FP-ESR25-MFG]
R40  ESR25JZPF2R00  [FP-ESR25-MFG]
U7  TQP369184  [SOT65P210X110-6N]
U8  UCC27511ADBVR  [FP-DBV0006A-IPC_B]

### Ports
+5V (in), DRV OUT (out), GND (in), RF IN (in), RF OUT (out)

### Nets
5V0_PA1: C35.1 R34.2 U8.1(VDD) ; port +5V  [project net PA1_VDD]
GND: C32.2 C35.2 U7.1(GND_1) U7.2(GND_2) U7.4(GND_3) U7.5(GND_4) U8.4(GND) U8.5(IN-) ; port GND
QOUT: R36.2 R38.2 ; port RF IN
NetC32_1: C32.1 L2.2 R34.1
NetC33_1: C33.1 L2.1 U7.6(RF_OUT)
NetC33_2: C33.2 R35.2
NetC34_1: C34.1 R36.1
NetC34_2: C34.2 U7.3(RF_IN)
NetJ4_1: R35.1 ; port RF OUT
NetQ1_1: R39.2 R40.2 ; port DRV OUT
NetR38_1: R38.1 U8.6(IN+)
NetR39_1: R39.1 U8.2(OUTH)
NetR40_1: R40.1 U8.3(OUTL)

### Library data of the parts
C32-C34 = CMP-2006-01326-1: Manufacturer: Vitramon; Part Number: VJ0603Y183KXAAC
C35 = CMP-2000-04979-3: as C1 on sheet MCU; Dielectric Material: Ceramic; Construction: Flat; Height: 0.8mm; Thickness: 0.035inch; Case Code (Metric): 1608; Radiation Hardening: No; Number of Pins: 2; Voltage Rating (DC): 10V; Depth: 0.8mm; Voltage: 10V; RoHS Compliant: Yes; Voltage Rating: 10V; Package Quantity: 1; Resistor Type: Ceramic; Termination: SMD/SMT; Lead Free: Lead Free; REACH SVHC: No SVHC; Tolerance: 10%; Mount: Surface Mount; Series: C; Packaging: Tape and Reel; Width: 0.8mm; Dielectric: X5R; Weight: 7.1E-05oz; Length: 1.6mm; Max Operating Temperature: 85°C; Case Code (Imperial): 0603; Case/Package: 0603; Min Operating Temperature: -55°C
L2 = CMP-06042-016197-1: Multilayer Type Inductor for General Circuits, 0603 (1608), 820nH, 10%, 2.1Ω, 35mA; Self Resonant Frequency: 85MHz; Shielding: Shielded; DC Resistance (DCR): 2.1R; Test Frequency: 25MHz; Core Material: Ferrite; Q Factor: 15; RoHS Compliant: Yes; Length: 1.6mm; Max Operating Temperature: 85°C; Case Code (Metric): 1608; Lead Free: Lead Free; Package Quantity: 1; Series: LQM18N; Height - Seated (Max): 0.037inch; Current Rating: 35mA; Radiation Hardening: No; REACH SVHC: No SVHC; Termination: SMD/SMT; Case Code (Imperial): 0603; Width: 0.031inch; Height: 0.8mm; Tolerance: 10%; Military Standard: Not; Mount: Surface Mount; Max DC Current: 35mA; Depth: 0.95mm; Inductance: 820nH; Min Operating Temperature: -40°C; DC Current: 35mA; Case/Package: 0603; Packaging: Tape and Reel
R34 = CMP-08839-028611-1: 24Ω ±5% 0.4W 0805 Anti-Surge Chip Resistor AEC-Q200; Temperature Coefficient: 200ppm/°C; Resistance: 24R; Max Power Dissipation: 400mW; Tolerance: 5%; RoHS Compliant: Yes; Max Operating Temperature: 155°C; Min Operating Temperature: -55°C; Resistor Type: Thick Film; Width: 0.049inch; Length: 0.079inch; Number of Terminations: 2; Height: 0.026inch; Case Code (Imperial): 0805; Series: ESR; Case/Package: 0805; Case Code (Metric): 2012; Packaging: Tape and Reel; Features: Automotive AEC-Q200; Package Quantity: 1
R35 R36 R38 = CMP-26527-006412-1: as R9 on sheet System; Width: 0.031inch; RoHS Compliant: Yes; Number of Terminations: 2; Case/Package: 0603; Contact Plating: Tin; Height: 0.022inch; Resistor Type: Thick Film; Mount: Surface Mount; Length: 0.061inch; Features: Automotive AEC-Q200; Series: RMCF; Max Operating Temperature: 155°C; Radiation Hardening: No; Min Operating Temperature: -55°C; Packaging: Tape and Reel
R39 R40 = CMP-08839-008954-1: 2Ω ±1% 0.66W 1210 Anti-Surge Chip Resistor AEC-Q200; Temperature Coefficient: 100ppm/°C; Resistance: 2R; Power Rating: 500mW; Series: ESR; RoHS Compliant: Yes; Number of Terminations: 2; Length: 0.126inch; Case/Package: 1210; Min Operating Temperature: -55°C; Width: 0.098inch; Lead Free: Lead Free; Packaging: Tape and Reel; Features: Automotive AEC-Q200; Height: 0.026inch; Case Code (Imperial): 1210; Case Code (Metric): 3225; Size Code: 1210; Package Quantity: 1; Max Operating Temperature: 155°C; Resistor Type: Thick Film; Max Power Dissipation: 500mW; Tolerance: 1%
U7 = TQP369184: DC  6 GHz Gain Block; Manufacturer_Name: Qorvo; Geometry.Height: 1.1mm; Mouser Part Number: 772-TQP369184; Mouser Price/Stock: https://www.mouser.co.uk/ProductDetail/Qorvo/TQP369184?qs=opBjA1TV900HByuIeJCWsQ%3D%3D; Manufacturer_Part_Number: TQP369184; Datasheet Link: https://www.qorvo.com/products/d/da005471
U8 = CMP-04912-000035-1: IC GATE DRVR LOW-SIDE SOT23-6; Number of Drivers: 1; Max Output Current: 8A; Channel Type: Single; Case/Package: SOT-23-6; Mount: Surface Mount; Max Operating Temperature: 140°C; Packaging: Tape and Reel; Min Operating Temperature: -40°C; RoHS Compliant: Yes; Number of Channels: 1

## Sheet PA stage 2.SchDoc
size A; SheetNumber: 9; SheetTotal: 12
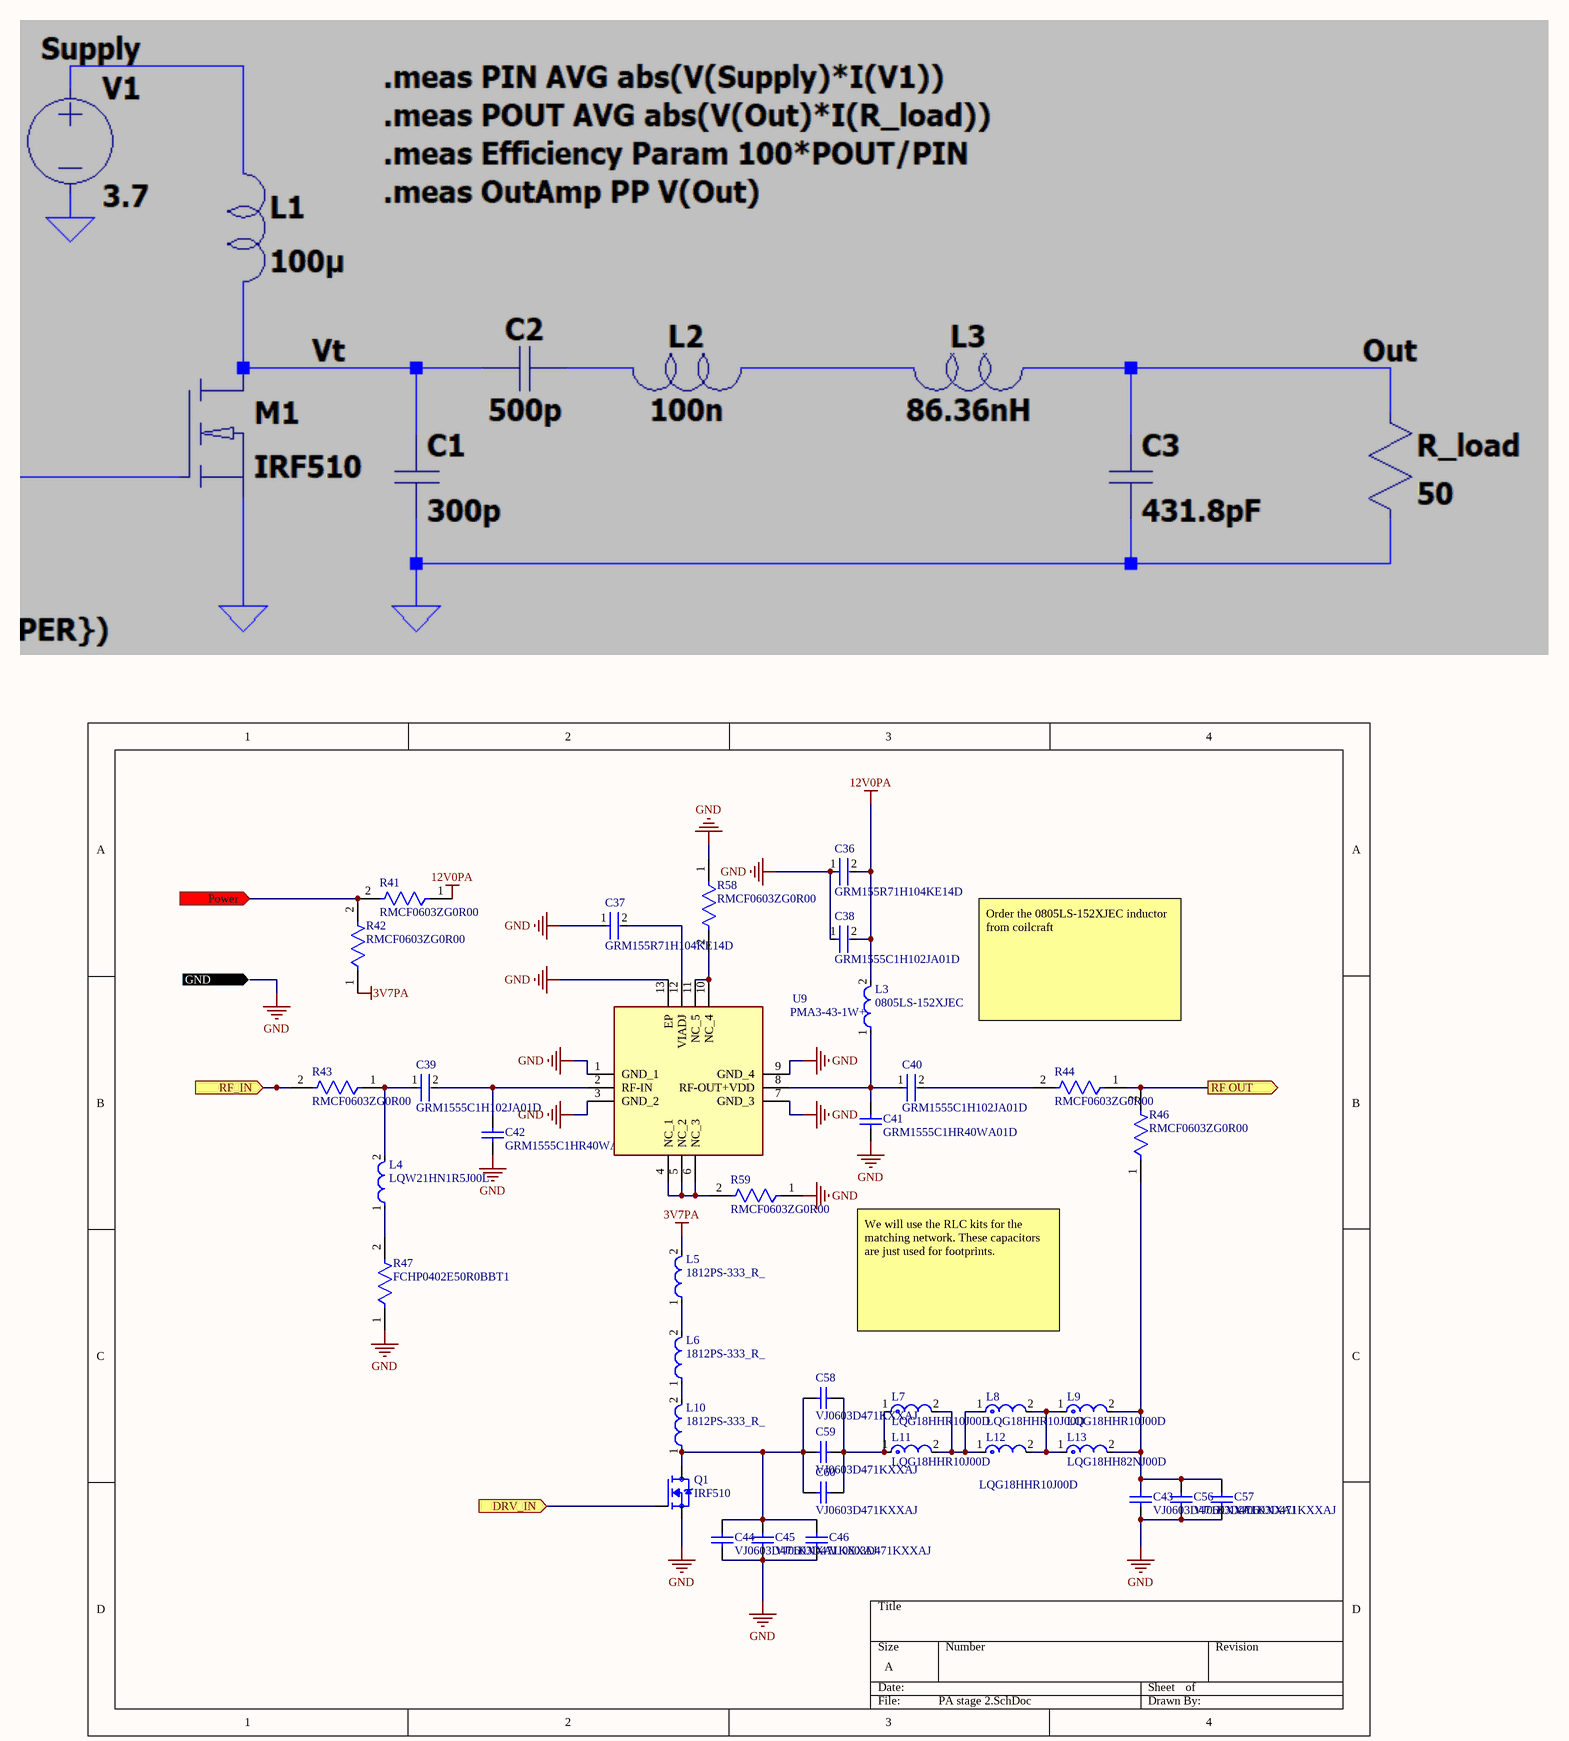
[diagram p4: PA stage 2.SchDoc]

### Parts
C36  GRM155R71H104KE14D  [FP-GRM155-0_05-IPC_B]
C37  GRM155R71H104KE14D  [FP-GRM155-0_05-IPC_B]
C38  GRM1555C1H102JA01D  [FP-GRM155-0_05-IPC_B]
C39  GRM1555C1H102JA01D  [FP-GRM155-0_05-IPC_B]
C40  GRM1555C1H102JA01D  [FP-GRM155-0_05-IPC_B]
C41  GRM1555C1HR40WA01D  [CAPC1005X55X25LL05T10]
C42  GRM1555C1HR40WA01D  [CAPC1005X55X25LL05T10]
C43  VJ0603D471KXXAJ  [CAPC1608X92X38LL15T08]
C44  VJ0603D471KXXAJ  [CAPC1608X92X38LL15T08]
C45  VJ0603D471KXXAJ  [CAPC1608X92X38LL15T08]
C46  VJ0603D471KXXAJ  [CAPC1608X92X38LL15T08]
C56  VJ0603D471KXXAJ  [CAPC1608X92X38LL15T08]
C57  VJ0603D471KXXAJ  [CAPC1608X92X38LL15T08]
C58  VJ0603D471KXXAJ  [CAPC1608X92X38LL15T08]
C59  VJ0603D471KXXAJ  [CAPC1608X92X38LL15T08]
C60  VJ0603D471KXXAJ  [CAPC1608X92X38LL15T08]
L3  0805LS-152XJEC  [FP-LQW21HN_00-MFG]
L4  LQW21HN1R5J00L  [FP-LQW21HN_00-MFG]
L5  1812PS-333_R_  [FP-1812PS-MFG]
L6  1812PS-333_R_  [FP-1812PS-MFG]
L7  LQG18HHR10J00D  [FP-LQG18HH_00-MFG]
L8  LQG18HHR10J00D  [FP-LQG18HH_00-MFG]
L9  LQG18HHR10J00D  [FP-LQG18HH_00-MFG]
L10  1812PS-333_R_  [FP-1812PS-MFG]
L11  LQG18HHR10J00D  [FP-LQG18HH_00-MFG]
L12  LQG18HHR10J00D  [FP-LQG18HH_00-MFG]
L13  LQG18HH82NJ00D  [FP-LQG18HH_00-IPC_B]
Q1  IRF510  [TO254P1051X465X1931-3]
R41  RMCF0603ZG0R00  [FP-RMCF0603-IPC_B]
R42  RMCF0603ZG0R00  [FP-RMCF0603-IPC_B]
R43  RMCF0603ZG0R00  [FP-RMCF0603-IPC_B]
R44  RMCF0603ZG0R00  [FP-RMCF0603-IPC_B]
R46  RMCF0603ZG0R00  [FP-RMCF0603-IPC_B]
R47  FCHP0402E50R0BBT1  [FP-FC0402-MFG]
R58  RMCF0603ZG0R00  [FP-RMCF0603-IPC_B]
R59  RMCF0603ZG0R00  [FP-RMCF0603-IPC_B]
U9  PMA3-43-1W+  [QFN51P300X300X89-13N]

### Ports
DRV_IN (in), GND (in), Power (in), RF OUT (out), RF_IN (in)

### Nets
3V7PA: L5.2 R42.1
12V0PA: C36.2 C38.2 L3.2 R41.1
GND: C36.1 C37.1 C38.1 C41.1 C42.1 C43.1 C44.1 C45.1 C46.1 C56.1 C57.1 Q1.3(S) R47.1 R58.1 R59.1 U9.1(GND_1) U9.3(GND_2) U9.7(GND_3) U9.9(GND_4) U9.13(EP) ; port GND
PA2_VDD: R41.2 R42.2 ; port Power
NetC37_2: C37.2 U9.12(VIADJ)
NetC39_1: C39.1 L4.2 R43.1
NetC39_2: C39.2 C42.2 U9.2(RF-IN)
NetC40_1: C40.1 C41.2 L3.1 U9.8(RF-OUT+VDD)
NetC40_2: C40.2 R44.2
NetC43_2: C43.2 C56.2 C57.2 L9.2 L13.2 R46.1
NetC44_2: C44.2 C45.2 C46.2 C58.2 C59.2 C60.2 L10.1 Q1.2(D)
NetC58_1: C58.1 C59.1 C60.1 L7.1 L11.1
NetJ4_1: R43.2 ; port RF_IN
NetJ5_1: R44.1 R46.2 ; port RF OUT
NetL4_1: L4.1 R47.2
NetL5_1: L5.1 L6.2
NetL6_1: L6.1 L10.2
NetL7_2: L7.2 L8.1 L11.2 L12.1
NetL8_2: L8.2 L9.1 L12.2 L13.1
NetQ1_1: Q1.1(G) ; port DRV_IN
NetR58_2: R58.2 U9.10(NC_4) U9.11(NC_5)
NetR59_2: R59.2 U9.4(NC_1) U9.5(NC_2) U9.6(NC_3)

### Notes on the sheet
- Order the 0805LS-152XJEC inductor from coilcraft
- We will use the RLC kits for the matching network. These capacitors are just used for footprints.

### Library data of the parts
C36 C37 = CMP-2008-04639-2: Chip Multilayer Ceramic Capacitors for General Purpose, 0402, 0.10uF, X7R, 15%, 10%, 50V; Dissipation Factor: 0.025%; Capacitance: 100nF; Weight: 0.000212oz; Thickness: 0.022inch; Voltage Rating (DC): 50V; Dielectric Material: Ceramic; Termination: SMD/SMT; Case/Package: 0402; Case Code (Imperial): 0402; Mount: Surface Mount; REACH SVHC: No SVHC; Resistor Type: Ceramic; Dielectric: X7R; Max Operating Temperature: 125°C; Voltage: 50V; Lead Free: Lead Free; Package Quantity: 10000; Packaging: Tape and Reel; Length: 1mm; Material: Ceramic; Height: 0.5mm; Depth: 0.5mm; Width: 0.5mm; Min Operating Temperature: -55°C; Tolerance: 10%; Case Code (Metric): 1005; Voltage Rating: 50V
C38-C40 = CMP-2008-04254-2: Chip Multilayer Ceramic Capacitors for General Purpose, 0402, 1000pF, C0G, 30ppm/°C, 5%, 50V; Insulation Resistance: 10GR; Capacitance: 1nF; Packaging: Tape and Reel; Lead Free: Lead Free; Tolerance: 5%; Temperature Coefficient: 30ppm/°C; Thickness: 0.022inch; Termination: SMD/SMT; Max Operating Temperature: 125°C; Height: 0.5mm; Package Quantity: 1; Radiation Hardening: No; Material: Ceramic; Case Code (Metric): 1005; Number of Pins: 2; Voltage Rating: 50V; Mount: Surface Mount; Voltage: 50V; Case/Package: 0402; Min Operating Temperature: -55°C; Dielectric Material: Ceramic; Width: 0.5mm; Depth: 0.5mm; Case Code (Imperial): 0402; REACH SVHC: No SVHC; Dielectric: C0G; Voltage Rating (DC): 50V; Length: 1mm
C41 C42 = CMP-1034-00010-2: Manufacturer: Murata; Part Number: GRM1555C1HR40WA01D
C43-C46 C56-C60 = CMP-2006-01521-1: Manufacturer: Vitramon; Part Number: VJ0603D471KXXAJ
L3 = CMP-06042-001639-1: 0805LS-152XJEC Coilcraft; Core Material: Ferrite; DC Current: 85mA; DC Resistance (DCR): 5.33R; Self Resonant Frequency: 350MHz; Shielding: Unshielded; Inductance: 1.5uH; Test Frequency: 10MHz; Tolerance: 5%; Q Factor: 35; Width: 0.047inch; Case Code (Metric): 2012; Current Rating: 85mA; Mount: Surface Mount; Max DC Current: 85mA; Length: 2mm; Height - Seated (Max): 0.039inch; Depth: 1.4mm; Min Operating Temperature: -40°C; Termination: SMD/SMT; Military Standard: Not; Radiation Hardening: No; Packaging: Tape and Reel; Resistor Type: Wirewound; Case/Package: 0805; Case Code (Imperial): 0805; Weight: 0.000282oz; Height: 0.9mm; Package Quantity: 3000; Max Operating Temperature: 85°C
L4 = CMP-06042-001639-1: Wire Wound Ferrite type RF Inuctor 1.5uH ±5% 85mA 5.33Ω 0805 (2012); DC Resistance (DCR): 5.33R; Self Resonant Frequency: 350MHz; Shielding: Unshielded; Test Frequency: 10MHz; Q Factor: 35; Width: 0.047inch; Core Material: Ferrite; Case Code (Metric): 2012; DC Current: 85mA; Current Rating: 85mA; Mount: Surface Mount; Max DC Current: 85mA; Length: 2mm; Height - Seated (Max): 0.039inch; Depth: 1.4mm; Min Operating Temperature: -40°C; Termination: SMD/SMT; Military Standard: Not; Radiation Hardening: No; Packaging: Tape and Reel; Resistor Type: Wirewound; Case/Package: 0805; Case Code (Imperial): 0805; Inductance: 1.5uH; Weight: 0.000282oz; Height: 0.9mm; Package Quantity: 3000; Max Operating Temperature: 85°C; Tolerance: 5%
L5 L6 = CMP-11268-000188-1: 1812PS-333_R_Coilcraft; Core Material: Ferrite; Test Frequency: 100kHz; DC Resistance (DCR): 170mR; Inductance: 10uH; Self Resonant Frequency: 120MHz; Q Factor: 40; Shielding: Shielded; Tolerance: 5%; Max DC Current: 1.7A; Height: 3.81mm; Length: 5.87mm; Case/Package: 1812; Series: 1812PS; Packaging: Tape and Reel; Package Quantity: 600; Width: 4.98mm; Max Operating Temperature: 105°C; Termination: SMD/SMT; Lead Free: Contains Lead; Min Operating Temperature: -40°C; RoHS Compliant: Yes
L7-L9 L11 L12 = CMP-06042-004589-1: Multilayer type Inductor for Automotive 100nH ±5% 0.9Ω 300mA 0603; DC Resistance (DCR): 4.18mR; Termination: SMD/SMT; Package Quantity: 4000; Inductance: 100nH; Case/Package: 0603; Packaging: Tape and Reel
L10 = CMP-11268-000188-1: 1812PS-333_R_ Coilcraft; Core Material: Ferrite; Test Frequency: 100kHz; DC Resistance (DCR): 170mR; Inductance: 10uH; Self Resonant Frequency: 120MHz; Q Factor: 40; Shielding: Shielded; Tolerance: 5%; Max DC Current: 1.7A; Height: 3.81mm; Length: 5.87mm; Case/Package: 1812; Series: 1812PS; Packaging: Tape and Reel; Package Quantity: 600; Width: 4.98mm; Max Operating Temperature: 105°C; Termination: SMD/SMT; Lead Free: Contains Lead; Min Operating Temperature: -40°C; RoHS Compliant: Yes
L13 = CMP-06042-003651-1: Multilayer type Inductor for Automotive 82nH ±5% 0.85Ω 300mA 0603; DC Resistance (DCR): 4.18mR; Case/Package: 0603; Termination: SMD/SMT; Packaging: Tape and Reel; Inductance: 82nH; Package Quantity: 4000
Q1 = IRF510: N-Channel 100 V 5.6A (Tc) 3.7W (Ta), 43W (Tc) Surface Mount DÂ²PAK (TO-263); MF: Vishay Siliconix; SnapEDA_Link: https://www.snapeda.com/parts/IRF510/Vishay+Siliconix/view-part/?ref=snap; Package: TO-220-3 Vishay; Value: *; MP: IRF510; Check_prices: https://www.snapeda.com/parts/IRF510/Vishay+Siliconix/view-part/?ref=eda
R41-R44 R46 R58 R59 = CMP-26527-006412-1: as R9 on sheet System; Width: 0.031inch; RoHS Compliant: Yes; Number of Terminations: 2; Case/Package: 0603; Contact Plating: Tin; Height: 0.022inch; Resistor Type: Thick Film; Mount: Surface Mount; Length: 0.061inch; Features: Automotive AEC-Q200; Series: RMCF; Max Operating Temperature: 155°C; Radiation Hardening: No; Min Operating Temperature: -55°C; Packaging: Tape and Reel
R47 = CMP-05494-120702529-1: FCHP0402E50R0BBT1 SMD Chip Resistor, 50 Ohm, ± 0.1%, 1 W, 0402 [1005 Metric], Thin Film, High Frequency; Power Rating: 1W; Voltage Rating: 30V; Temperature Coefficient: 25ppm/°C; Resistance: 50Ω; Max Operating Temperature: 155°C; Min Operating Temperature: -55°C; Composition: Thin Film; Schedule B: 8533210045; Case/Package: 0402; Tolerance: 0.1%; Height: 419.1µm; NexarPartId: 120702529
U9 = PMA3-43-1W+: Integrated Circuit; Manufacturer_Name: Mini-Circuits; Datasheet Link: https://www.minicircuits.com/pdfs/PMA3-43-1W+.pdf; Height: 0.89mm; Manufacturer_Part_Number: PMA3-43-1W+

## Sheet LDO.SchDoc
size A; SheetNumber: 6; SheetTotal: 12
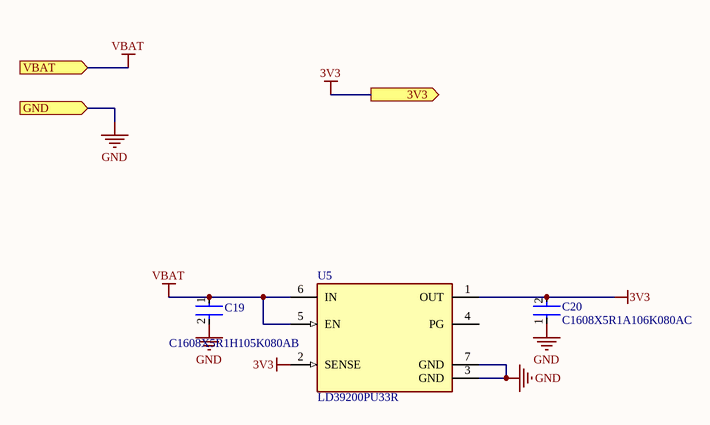
[diagram p5: LDO.SchDoc]

### Parts
C19  C1608X5R1H105K080AB  [FP-C1608-080-0_1-IPC_B]
C20  C1608X5R1A106K080AC  [FP-C1608-080-0_1-MFG]
U5  LD39200PU33R  [FP-DFN6-7946637-MFG]

### Ports
3V3 (out), GND (in), VBAT (in)

### Nets
3V3: C20.2 U5.1(OUT) U5.2(SENSE) ; port 3V3
GND: C19.2 C20.1 U5.3(GND) U5.7(GND) ; port GND
VBAT: C19.1 U5.5(EN) U5.6(IN) ; port VBAT

Not connected (* = marked no-connect by the designer): U5 4(PG)

### Library data of the parts
C19 = CMP-2000-06025-2: Multilayer Ceramic Capacitors 1μF ±10% 50V X5R SMD 0603; Capacitance: 1uF; Lead Free: Lead Free; Height: 0.8mm; Mount: Surface Mount; Radiation Hardening: No; Thickness: 0.035inch; Length: 1.6mm; Max Operating Temperature: 85°C; REACH SVHC: No SVHC; Min Operating Temperature: -55°C; Construction: Flat; RoHS Compliant: Yes; Voltage Rating: 50V; Dielectric: X5R; Packaging: Tape and Reel; Termination: SMD/SMT; Voltage Rating (DC): 50V; Case Code (Imperial): 0603; Voltage: 50V; Width: 0.031inch; Weight: 7.1E-05oz; Depth: 0.8mm; Case Code (Metric): 1608; Series: C; Case/Package: 0603; Tolerance: 10%; Resistor Type: Ceramic; Number of Pins: 2; Dielectric Material: Ceramic; Package Quantity: 1
C20 = CMP-2000-04979-3: as C1 on sheet MCU; Dielectric Material: Ceramic; Construction: Flat; Height: 0.8mm; Thickness: 0.035inch; Case Code (Metric): 1608; Radiation Hardening: No; Number of Pins: 2; Voltage Rating (DC): 10V; Depth: 0.8mm; Voltage: 10V; RoHS Compliant: Yes; Voltage Rating: 10V; Package Quantity: 1; Resistor Type: Ceramic; Termination: SMD/SMT; Lead Free: Lead Free; REACH SVHC: No SVHC; Tolerance: 10%; Mount: Surface Mount; Series: C; Packaging: Tape and Reel; Width: 0.8mm; Dielectric: X5R; Weight: 7.1E-05oz; Length: 1.6mm; Max Operating Temperature: 85°C; Case Code (Imperial): 0603; Case/Package: 0603; Min Operating Temperature: -55°C
U5 = CMP-12153-000011-1: IC REG LINEAR 3.3V 2A 6DFN; Number of Outputs: 1; Max Input Voltage: 6V; Output Type: Fixed; Min Input Voltage: 1.25V; Dropout Voltage: 130mV; Operating Supply Current: 1mA; Number of Regulators: 1; Case/Package: DFN; Packaging: Tape and Reel; Output Current: 2A; Min Operating Temperature: -40°C; Mount: Surface Mount; Output Voltage: 3.3V; Max Operating Temperature: 125°C; Lead Free: Lead Free; Package Quantity: 3000

## Sheet Output.SchDoc
size A; SheetNumber: 10; SheetTotal: 12
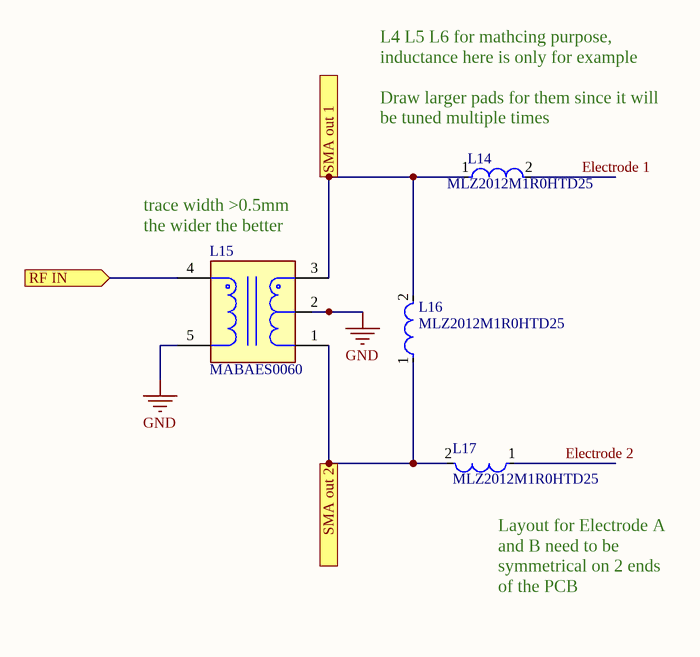
[diagram p6: Output.SchDoc]

### Parts
L14  MLZ2012M1R0HTD25  [FP-MLZ2012-1_25-IPC_C]
L15  MABAES0060  [FP-MABAES0060-MFG]
L16  MLZ2012M1R0HTD25  [FP-MLZ2012-1_25-IPC_C]
L17  MLZ2012M1R0HTD25  [FP-MLZ2012-1_25-IPC_C]

### Ports
RF IN (in), SMA out 1 (out), SMA out 2 (out)

### Nets
GND: L15.2(Secondary_CT) L15.5(Primary)
Electrode 1: L14.2
Electrode 2: L17.1
NetJ3_1: L14.1 L15.3(Secondary_Dot) L16.2 ; port SMA out 1
NetJ5_1: L15.4(Primary_dot) ; port RF IN
NetJ6_1: L15.1(Secondary) L16.1 L17.2 ; port SMA out 2

### Notes on the sheet
- (near L14) L4 L5 L6 for mathcing purpose, inductance here is only for example
  Draw larger pads for them since it will be tuned multiple times
- (near L15) trace width >0.5mm the wider the better
- (near L17) Layout for Electrode A and B need to be symmetrical on 2 ends of the PCB

### Library data of the parts
L14 L16 L17 = CMP-08253-000383-1: Shielded Multilayer Inductor 1uH ±20% 800mA 130mΩ AEC-Q200 SMD 0805; Core Material: Ferrite; Test Frequency: 2MHz; DC Resistance (DCR): 130mR; Saturation Current: 700mA; Height: 1.25mm; Min Operating Temperature: -55°C; Max DC Current: 800mA; Mount: Surface Mount; Height - Seated (Max): 0.057inch; Tolerance: 20%; Package Quantity: 2000; Case/Package: 0805; Current Rating: 800mA; Inductance: 1uH; Case Code (Metric): 2012; Max Operating Temperature: 125°C; RoHS Compliant: Yes; Case Code (Imperial): 0805; Shielding: Shielded; Ratings: AEC-Q200; Length: 0.079inch; Termination: SMD/SMT; Packaging: Tape and Reel; Width: 0.049inch; Weight: 0.000194oz
L15 = CMP-97513-000003-1: BALUN 300KHZ-200MHZ 1:1 6SMD; Insertion Loss: 1.5dB; Lead/Base Style: Gull Wing; Max DC Current: 500mA; Power Rating: 500mW; Package Quantity: 2000; Lead Free: Lead Free; Case/Package: SMD/SMT; Number of Pins: 5; Width: 3.81mm; Turns Ratio: 1:1; Depth: 3.81mm; Height: 2.67mm; Min Operating Temperature: -40°C; Termination: SMD/SMT; Length: 3.81mm; Max Operating Temperature: 85°C; Packaging: Tape and Reel; Radiation Hardening: No; Mount: Surface Mount